# Altium schematic sheet Main.SchDoc
size A; SheetNumber: 1; SheetTotal: 4
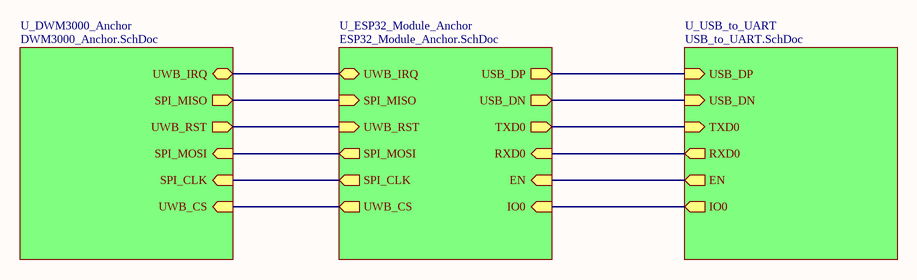
[diagram p0: Main.SchDoc]

## Sub-sheets
U_DWM3000_Anchor = DWM3000_Anchor.SchDoc: UWB_IRQ (bidir), SPI_MOSI (in), SPI_MISO (out), SPI_CLK (in), UWB_CS (in), UWB_RST (out)
U_ESP32_Module_Anchor = ESP32_Module_Anchor.SchDoc: UWB_IRQ (bidir), SPI_MOSI (out), SPI_MISO (in), SPI_CLK (out), UWB_CS (out), UWB_RST (in), USB_DP (out), USB_DN (out), TXD0 (out), RXD0 (in), EN (in), IO0 (in)
U_USB_to_UART = USB_to_UART.SchDoc: USB_DP (in), USB_DN (in), TXD0 (in), RXD0 (out), EN (out), IO0 (out)

## Nets
(unnamed): sheet U_ESP32_Module_Anchor/UWB_IRQ, sheet U_DWM3000_Anchor/UWB_IRQ
(unnamed): sheet U_ESP32_Module_Anchor/SPI_MOSI, sheet U_DWM3000_Anchor/SPI_MOSI
(unnamed): sheet U_ESP32_Module_Anchor/SPI_MISO, sheet U_DWM3000_Anchor/SPI_MISO
(unnamed): sheet U_ESP32_Module_Anchor/SPI_CLK, sheet U_DWM3000_Anchor/SPI_CLK
(unnamed): sheet U_ESP32_Module_Anchor/UWB_CS, sheet U_DWM3000_Anchor/UWB_CS
(unnamed): sheet U_ESP32_Module_Anchor/UWB_RST, sheet U_DWM3000_Anchor/UWB_RST
(unnamed): sheet U_ESP32_Module_Anchor/USB_DP, sheet U_USB_to_UART/USB_DP
(unnamed): sheet U_ESP32_Module_Anchor/USB_DN, sheet U_USB_to_UART/USB_DN
(unnamed): sheet U_ESP32_Module_Anchor/TXD0, sheet U_USB_to_UART/TXD0
(unnamed): sheet U_ESP32_Module_Anchor/RXD0, sheet U_USB_to_UART/RXD0
(unnamed): sheet U_ESP32_Module_Anchor/EN, sheet U_USB_to_UART/EN
(unnamed): sheet U_ESP32_Module_Anchor/IO0, sheet U_USB_to_UART/IO0